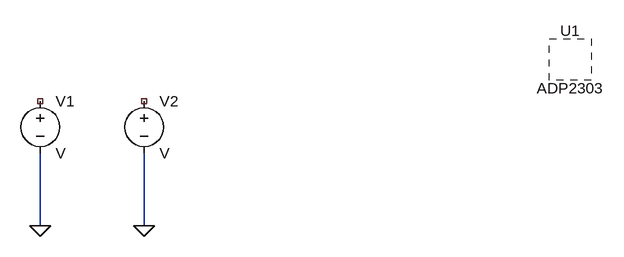
[diagram p0: schematic Draft2.asc]
Draft2.asc, the LTspice schematic file:
Version 4
SHEET 1 880 680
WIRE -576 608 -576 496
WIRE -416 608 -416 496
FLAG -576 608 0
FLAG -416 608 0
SYMBOL ADP2303 240 352 R0
SYMATTR InstName U1
SYMBOL Voltage -576 400 R0
SYMATTR InstName V1
SYMBOL Voltage -416 400 R0
SYMATTR InstName V2

The netlist it stands for:
* Draft2.asc
* U1: ADP2303 (symbol ADP2303 not available, pin order unknown); nets seen at it: 
V1 NC_01 0 V
V2 NC_02 0 V
.backanno
.end